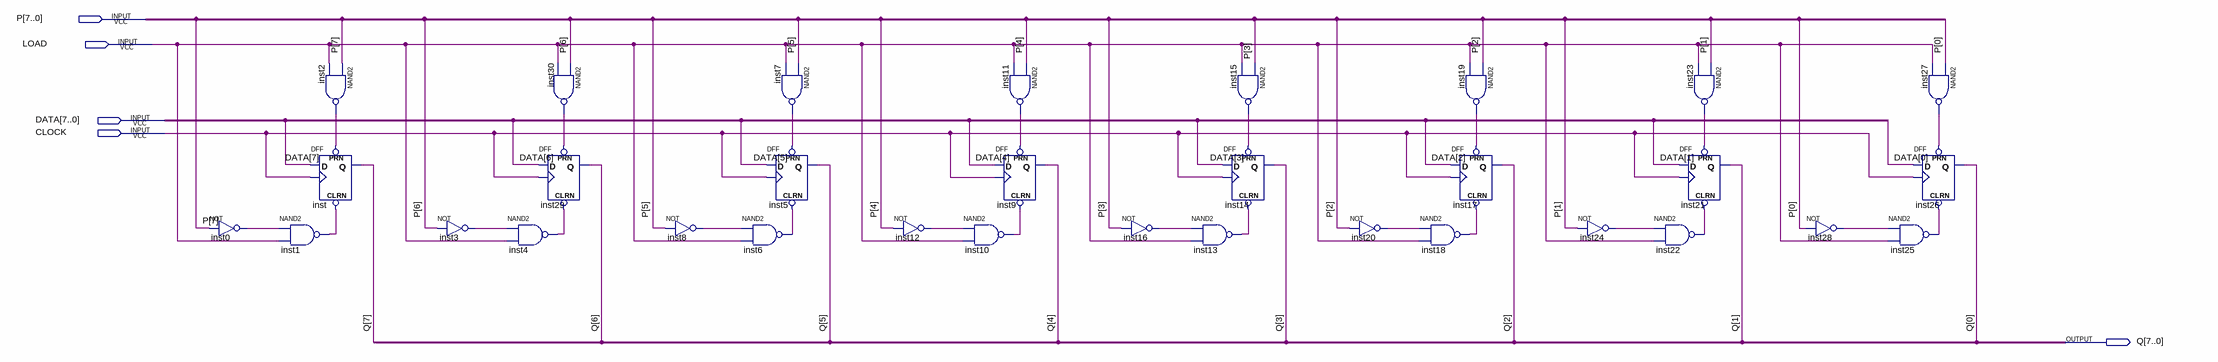
[diagram p0: schematic sheet]
// Quartus schematic REGISTRADOR_8BIT.bdf as structural Verilog: 32 symbols, 5 pins
module REGISTRADOR_8BIT (
  input  [7:0] P,
  input  LOAD,
  input  [7:0] DATA,
  input  CLOCK,
  output [7:0] Q
);

  wire inst0_out, inst1_out, inst2_out, inst3_out, inst4_out, inst6_out, inst7_out, inst8_out, inst10_out,
       inst11_out, inst12_out, inst13_out, inst15_out, inst16_out, inst18_out, inst19_out, inst20_out,
       inst22_out, inst23_out, inst24_out, inst25_out, inst27_out, inst28_out, inst30_out;

  not inst0 (inst0_out, P[7]);
  nand inst1 (inst1_out, inst0_out, LOAD);
  nand inst2 (inst2_out, P[7], LOAD);
  DFF inst (.CLRN(inst1_out), .CLK(CLOCK), .D(DATA[7]), .PRN(inst2_out), .Q(Q[7]));
  not inst3 (inst3_out, P[6]);
  nand inst4 (inst4_out, inst3_out, LOAD);
  nand inst30 (inst30_out, P[6], LOAD);
  DFF inst29 (.CLRN(inst4_out), .CLK(CLOCK), .D(DATA[6]), .PRN(inst30_out), .Q(Q[6]));
  not inst8 (inst8_out, P[5]);
  nand inst7 (inst7_out, P[5], LOAD);
  DFF inst5 (.CLRN(inst6_out), .CLK(CLOCK), .D(DATA[5]), .PRN(inst7_out), .Q(Q[5]));
  nand inst6 (inst6_out, inst8_out, LOAD);
  not inst12 (inst12_out, P[4]);
  nand inst10 (inst10_out, inst12_out, LOAD);
  nand inst11 (inst11_out, P[4], LOAD);
  DFF inst9 (.CLRN(inst10_out), .CLK(CLOCK), .D(DATA[4]), .PRN(inst11_out), .Q(Q[4]));
  not inst16 (inst16_out, P[3]);
  nand inst13 (inst13_out, inst16_out, LOAD);
  nand inst15 (inst15_out, P[3], LOAD);
  DFF inst14 (.CLRN(inst13_out), .CLK(CLOCK), .D(DATA[3]), .PRN(inst15_out), .Q(Q[3]));
  not inst20 (inst20_out, P[2]);
  nand inst18 (inst18_out, inst20_out, LOAD);
  nand inst19 (inst19_out, P[2], LOAD);
  DFF inst17 (.CLRN(inst18_out), .CLK(CLOCK), .D(DATA[2]), .PRN(inst19_out), .Q(Q[2]));
  not inst24 (inst24_out, P[1]);
  nand inst23 (inst23_out, P[1], LOAD);
  DFF inst21 (.CLRN(inst22_out), .CLK(CLOCK), .D(DATA[1]), .PRN(inst23_out), .Q(Q[1]));
  nand inst22 (inst22_out, inst24_out, LOAD);
  not inst28 (inst28_out, P[0]);
  nand inst25 (inst25_out, inst28_out, LOAD);
  nand inst27 (inst27_out, P[0], LOAD);
  DFF inst26 (.CLRN(inst25_out), .CLK(CLOCK), .D(DATA[0]), .PRN(inst27_out), .Q(Q[0]));
endmodule
